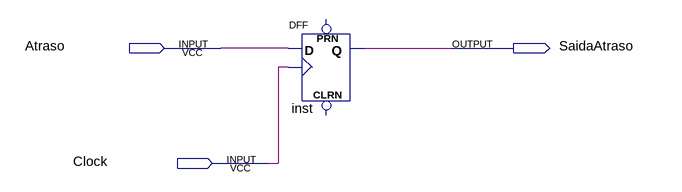
[diagram p0: schematic sheet]
// Quartus schematic Atraso.bdf as structural Verilog: 1 symbols, 3 pins
module Atraso (
  input  Atraso,
  input  Clock,
  output SaidaAtraso
);

  DFF inst (.CLK(Clock), .D(Atraso), .Q(SaidaAtraso));  // open: CLRN, PRN
endmodule
